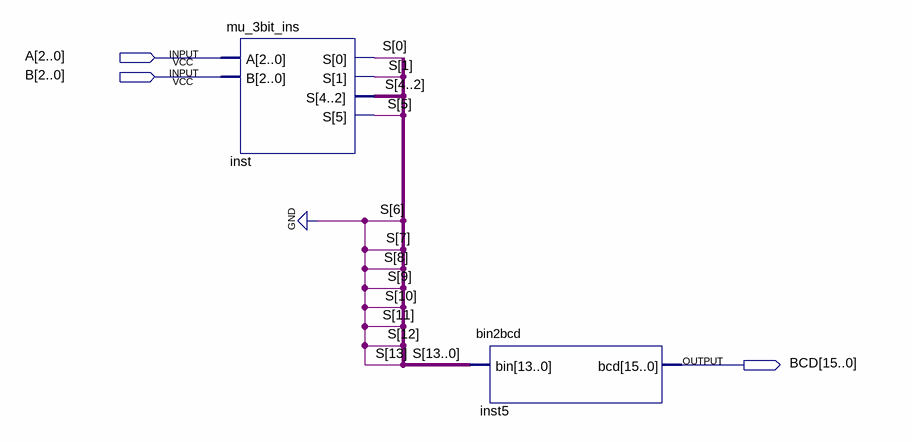
[diagram p0: schematic sheet]
// Quartus schematic mu3_3_to_BCD.bdf as structural Verilog: 2 symbols, 3 pins
module mu3_3_to_BCD (
  input  [2:0] A,
  input  [2:0] B,
  output [15:0] BCD
);

  wire [5:0] S;

  mu_3bit_ins inst (.A(A), .B(B), .S(S));
  bin2bcd inst5 (.bin({{8{1'b0}}, S}), .bcd(BCD));
endmodule
